# EAGLE design traduttore (EAGLE 9.1.2)
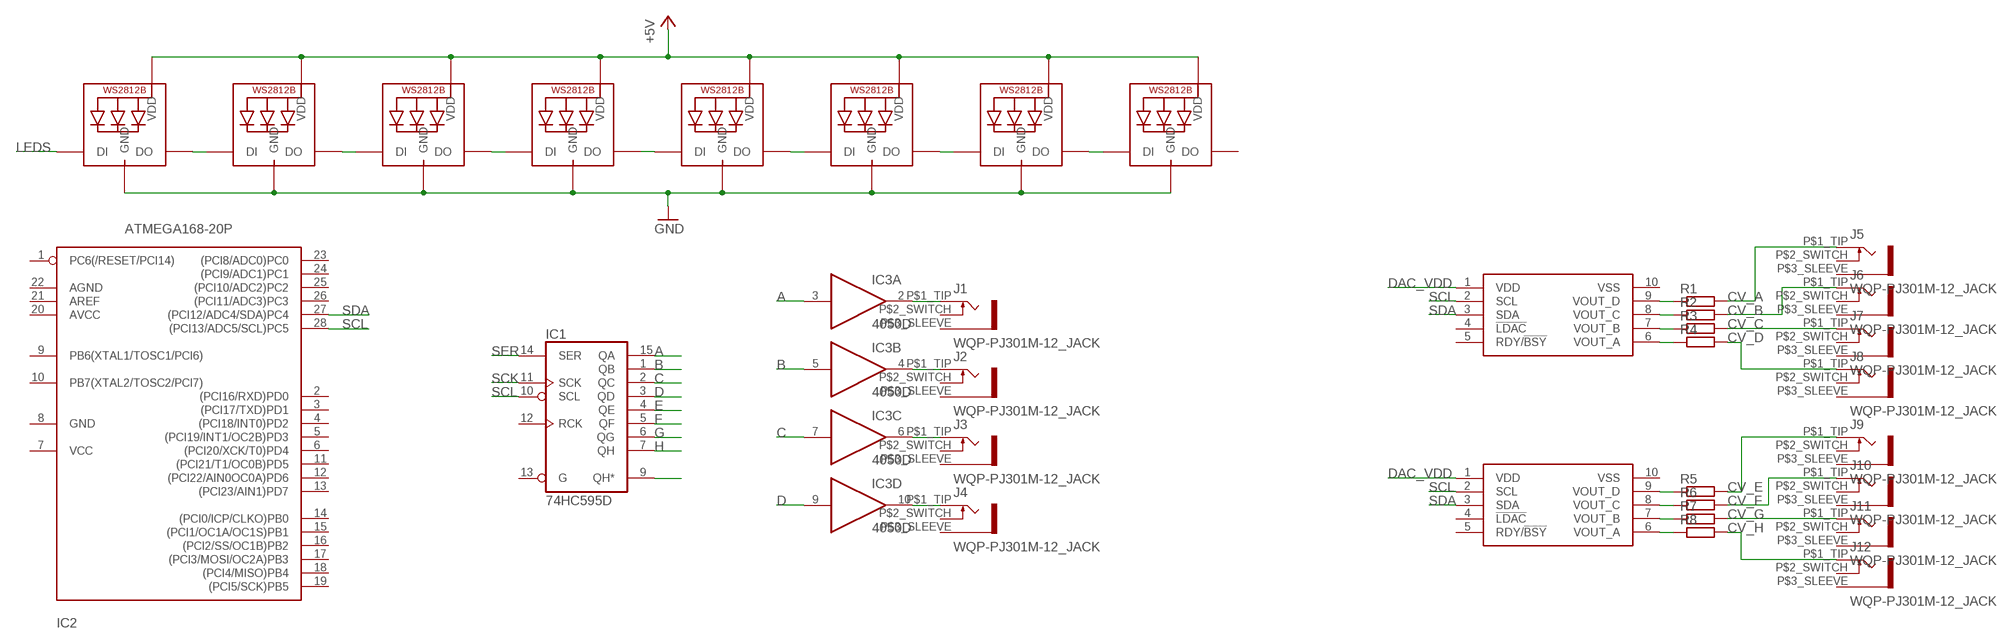
[diagram p0: schematic, sheet 1]

## Parts
IC1  74HC595D  [SO16]
IC2  ATMEGA168-20P  [DIL28-3]
IC3  4050D  [SO16]
J1  WQP-PJ301M-12_JACK  [WQP-PJ301M-12_JACK]
J2  WQP-PJ301M-12_JACK  [WQP-PJ301M-12_JACK]
J3  WQP-PJ301M-12_JACK  [WQP-PJ301M-12_JACK]
J4  WQP-PJ301M-12_JACK  [WQP-PJ301M-12_JACK]
J5  WQP-PJ301M-12_JACK  [WQP-PJ301M-12_JACK]
J6  WQP-PJ301M-12_JACK  [WQP-PJ301M-12_JACK]
J7  WQP-PJ301M-12_JACK  [WQP-PJ301M-12_JACK]
J8  WQP-PJ301M-12_JACK  [WQP-PJ301M-12_JACK]
J9  WQP-PJ301M-12_JACK  [WQP-PJ301M-12_JACK]
J10  WQP-PJ301M-12_JACK  [WQP-PJ301M-12_JACK]
J11  WQP-PJ301M-12_JACK  [WQP-PJ301M-12_JACK]
J12  WQP-PJ301M-12_JACK  [WQP-PJ301M-12_JACK]
LED1  WS2812B5050  [WS2812B]
LED2  WS2812B5050  [WS2812B]
LED3  WS2812B5050  [WS2812B]
LED4  WS2812B5050  [WS2812B]
LED5  WS2812B5050  [WS2812B]
LED6  WS2812B5050  [WS2812B]
LED7  WS2812B5050  [WS2812B]
LED8  WS2812B5050  [WS2812B]
R1  R-EU_R0805  [R0805]
R2  R-EU_R0805  [R0805]
R3  R-EU_R0805  [R0805]
R4  R-EU_R0805  [R0805]
R5  R-EU_R0805  [R0805]
R6  R-EU_R0805  [R0805]
R7  R-EU_R0805  [R0805]
R8  R-EU_R0805  [R0805]
U$1  MCP4728  [MSOP10]
U$2  MCP4728  [MSOP10]

## Nets
+5V: LED1.1-VDD(VDD) LED2.1-VDD(VDD) LED3.1-VDD(VDD) LED4.1-VDD(VDD) LED5.1-VDD(VDD) LED6.1-VDD(VDD) LED7.1-VDD(VDD) LED8.1-VDD(VDD)
A: IC1.15(QA) IC3.3(A:I)
B: IC1.1(QB) IC3.5(B:I)
C: IC1.2(QC) IC3.7(C:I)
CV_A: J5.P$1_TIP R1.2
CV_B: J6.P$1_TIP R2.2
CV_C: J7.P$1_TIP R3.2
CV_D: J8.P$1_TIP R4.2
CV_E: J9.P$1_TIP R5.2
CV_F: J10.P$1_TIP R6.2
CV_G: J11.P$1_TIP R7.2
CV_H: J12.P$1_TIP R8.2
D: IC1.3(QD) IC3.9(D:I)
DAC_VDD: U$1.1(VDD) U$2.1(VDD)
E: IC1.4(QE)
F: IC1.5(QF)
G: IC1.6(QG)
GND: LED1.3-GND(GND) LED2.3-GND(GND) LED3.3-GND(GND) LED4.3-GND(GND) LED5.3-GND(GND) LED6.3-GND(GND) LED7.3-GND(GND) LED8.3-GND(GND)
H: IC1.7(QH)
LEDS: LED1.4-DIN(DI)
N$1: LED1.2-DOUT(DO) LED2.4-DIN(DI)
N$2: LED2.2-DOUT(DO) LED3.4-DIN(DI)
N$3: LED3.2-DOUT(DO) LED4.4-DIN(DI)
N$4: LED4.2-DOUT(DO) LED5.4-DIN(DI)
N$5: LED5.2-DOUT(DO) LED6.4-DIN(DI)
N$6: LED6.2-DOUT(DO) LED7.4-DIN(DI)
N$7: LED7.2-DOUT(DO) LED8.4-DIN(DI)
N$8: R1.1 U$1.9(VOUT_D)
N$9: R2.1 U$1.8(VOUT_C)
N$10: R3.1 U$1.7(VOUT_B)
N$11: R4.1 U$1.6(VOUT_A)
N$12: IC1.9(QH*)
N$13: IC3.2(A:O) J1.P$1_TIP
N$14: IC3.4(B:O) J2.P$1_TIP
N$15: IC3.6(C:O) J3.P$1_TIP
N$16: IC3.10(D:O) J4.P$1_TIP
N$17: R5.1 U$2.9(VOUT_D)
N$18: R6.1 U$2.8(VOUT_C)
N$19: R7.1 U$2.7(VOUT_B)
N$20: R8.1 U$2.6(VOUT_A)
SCK: IC1.11(SCK)
SCL: IC1.10(SCL) IC2.28((PCI13/ADC5/SCL)PC5) U$1.2(SCL) U$2.2(SCL)
SDA: IC2.27((PCI12/ADC4/SDA)PC4) U$1.3(SDA) U$2.3(SDA)
SER: IC1.14(SER)
Unconnected: IC1.12(RCK) IC1.13(G) IC2.1(PC6(/RESET/PCI14)) IC2.2((PCI16/RXD)PD0) IC2.3((PCI17/TXD)PD1) IC2.4((PCI18/INT0)PD2) IC2.5((PCI19/INT1/OC2B)PD3) IC2.6((PCI20/XCK/T0)PD4) IC2.7(VCC) IC2.8(GND) IC2.9(PB6(XTAL1/TOSC1/PCI6)) IC2.10(PB7(XTAL2/TOSC2/PCI7)) IC2.11((PCI21/T1/OC0B)PD5) IC2.12((PCI22/AIN0OC0A)PD6) IC2.13((PCI23/AIN1)PD7) IC2.14((PCI0/ICP/CLKO)PB0) IC2.15((PCI1/OC1A/OC1S)PB1) IC2.16((PCI2/SS/OC1B)PB2) IC2.17((PCI3/MOSI/OC2A)PB3) IC2.18((PCI4/MISO)PB4) IC2.19((PCI5/SCK)PB5) IC2.20(AVCC) IC2.21(AREF) IC2.22(AGND) IC2.23((PCI8/ADC0)PC0) IC2.24((PCI9/ADC1)PC1) IC2.25((PCI10/ADC2)PC2) IC2.26((PCI11/ADC3)PC3) IC3.11(E:I) IC3.12(E:O) IC3.14(F:I) IC3.15(F:O) J1.P$2_SWITCH J1.P$3_SLEEVE J2.P$2_SWITCH J2.P$3_SLEEVE J3.P$2_SWITCH J3.P$3_SLEEVE J4.P$2_SWITCH J4.P$3_SLEEVE J5.P$2_SWITCH J5.P$3_SLEEVE J6.P$2_SWITCH J6.P$3_SLEEVE J7.P$2_SWITCH J7.P$3_SLEEVE J8.P$2_SWITCH J8.P$3_SLEEVE J9.P$2_SWITCH J9.P$3_SLEEVE J10.P$2_SWITCH J10.P$3_SLEEVE J11.P$2_SWITCH J11.P$3_SLEEVE J12.P$2_SWITCH J12.P$3_SLEEVE LED8.2-DOUT(DO) U$1.4(!LDAC) U$1.5(RDY/!BSY) U$1.10(VSS) U$2.4(!LDAC) U$2.5(RDY/!BSY) U$2.10(VSS)

## Power pins joined to a net without a drawn wire
GND: IC1.8(GND)
VCC: IC1.16(VCC)
VDD: IC3.1(P:VDD)
VSS: IC3.8(P:VSS)

## Library data of the parts
IC1 = 74xx-eu:74*595: 8-bit SHIFT REGISTER, output latch
IC2 = adafruit:ATMEGA168*P: MICROCONTROLLER 16 kBytes FLASH 1 kBytes SRAM 512 Bytes EEPROM USART 8-channel 10 bit ADC
IC3 = 40xx:4050: Hex non-inverting BUFFER
J1-J12 = MusicThingModular:WQP-PJ301M-12_JACK
LED1-LED8 = adafruit:WS2812B
R1-R8 = resistor:R-EU_: RESISTOR, European symbol
U$1 U$2 = Eagle-Library:MCP4728

## Board
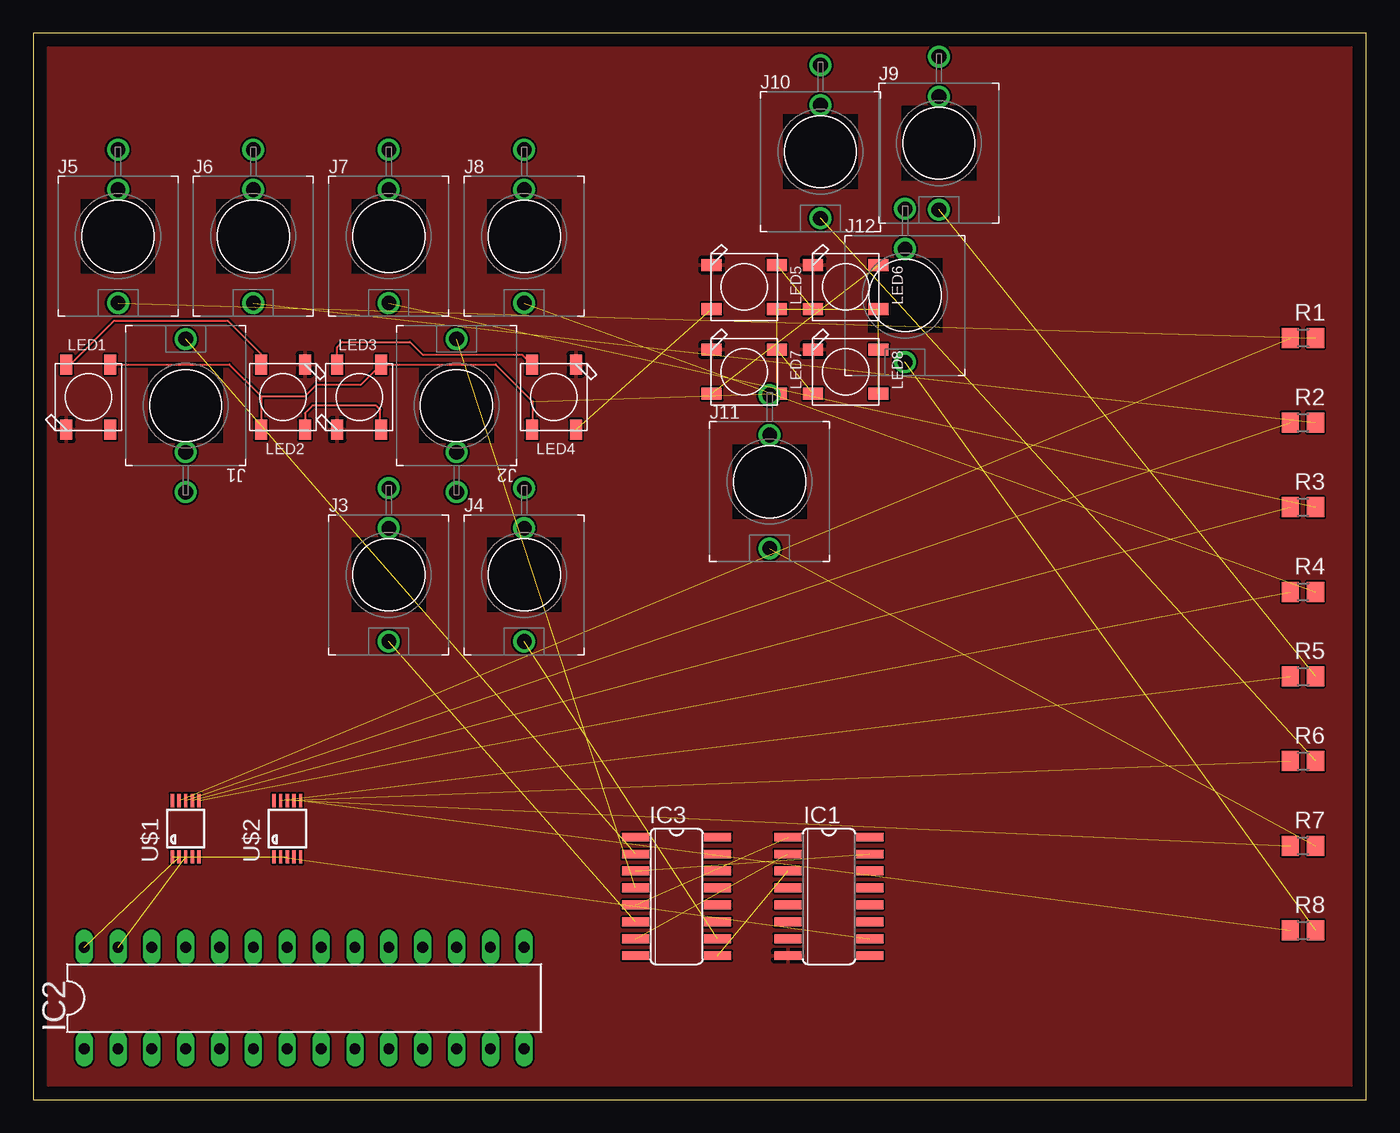
[diagram p1: board, top side]

Size 100 x 80 mm. Coordinates in mm from the lower left corner, seen from the top.
Outline: 0,0 100,0 100,80 0,80 0,0
Copper layers (1*16): Top 0.035mm / dielectric 1.5mm / Bottom 0.035mm
Design rules "default": minimum track width 6mil, minimum drill 0.35mm, track to track 6mil, track to pad 6mil, pad to pad 6mil, via to via 6mil, smd to smd 6mil, copper to edge 40mil, drill to drill 6mil, minimum pad ring 10mil, minimum via ring 8mil, stop-mask expansion 4mil, vias tented up to drill 0mil, thermal gap 10mil

### Footprints (pad centres in the part's own frame; a part is rotated, then mirrored left to right if it is on the bottom)
SO16 = smd 0.66 x 2.032: 1 -4.445,-3.073; 2 -3.175,-3.073; 3 -1.905,-3.073; 4 -0.635,-3.073; 5 0.635,-3.073; 6 1.905,-3.073; 7 3.175,-3.073; 8 4.445,-3.073; 9 4.445,3.073; 10 3.175,3.073; 11 1.905,3.073; 12 0.635,3.073; 13 -0.635,3.073; 14 -1.905,3.073; 15 -3.175,3.073; 16 -4.445,3.073
DIL28-3 = drill 0.813 long: 1 -16.51,-3.81; 2 -13.97,-3.81; 3 -11.43,-3.81; 4 -8.89,-3.81; 5 -6.35,-3.81; 6 -3.81,-3.81; 7 -1.27,-3.81; 8 1.27,-3.81; 9 3.81,-3.81; 10 6.35,-3.81; 11 8.89,-3.81; 12 11.43,-3.81; 13 13.97,-3.81; 14 16.51,-3.81; 15 16.51,3.81; 16 13.97,3.81; 17 11.43,3.81; 18 8.89,3.81; 19 6.35,3.81; 20 3.81,3.81; 21 1.27,3.81; 22 -1.27,3.81; 23 -3.81,3.81; 24 -6.35,3.81; 25 -8.89,3.81; 26 -11.43,3.81; 27 -13.97,3.81; 28 -16.51,3.81
WQP-PJ301M-12_JACK = drill 1.1: P$1_TIP 0,5; P$2_SWITCH 0,-3.5; P$3_SLEEVE 0,-6.5
WS2812B = smd 1.5 x 0.9: 1-VDD 2.45,-1.65; 2-DOUT 2.45,1.65; 3-GND -2.45,1.65; 4-DIN -2.45,-1.65
R0805 = smd 1.3 x 1.5: 1 -0.95,0; 2 0.95,0
MSOP10 = smd 0.25 x 1: 1 -1,-2.113; 2 -0.5,-2.113; 3 0,-2.113; 4 0.5,-2.113; 5 1,-2.113; 6 1,2.113; 7 0.5,2.113; 8 0,2.113; 9 -0.5,2.113; 10 -1,2.113

### Placement (x,y rotation side)
IC1  59.69,15.24 270 top
IC2  20.32,7.62 0 top
IC3  48.26,15.24 270 top
J1  11.43,52.07 0 top
J2  31.75,52.07 0 top
J3  26.67,39.37 180 top
J4  36.83,39.37 180 top
J5  6.35,64.77 180 top
J6  16.51,64.77 180 top
J7  26.67,64.77 180 top
J8  36.83,64.77 180 top
J9  67.94,71.75 180 top
J10  59.05,71.12 180 top
J11  55.24,46.35 180 top
J12  65.41,60.33 180 top
LED1  4.13,52.7 90 top
LED2  18.73,52.7 270 top
LED3  24.45,52.7 90 top
LED4  39.05,52.7 270 top
LED5  53.34,60.96 0 top
LED6  60.96,60.96 0 top
LED7  53.34,54.61 0 top
LED8  60.96,54.61 0 top
R1  95.25,57.15 0 top
R2  95.25,50.8 0 top
R3  95.25,44.45 0 top
R4  95.25,38.1 0 top
R5  95.25,31.75 0 top
R6  95.25,25.4 0 top
R7  95.25,19.05 0 top
R8  95.25,12.7 0 top
U$1  11.43,20.32 0 top
U$2  19.05,20.32 0 top

### Tracks (layer width: path | path; a pad name or v marks a point on that pad's centre or on a via)
+5V  (4 unrouted)
  Top 0.152: LED1.1-VDD 14.7,55.16 17.08,52.77 | 17.08,52.77 LED2.1-VDD | 17.08,52.77 20.38,52.77 21.27,53.66 24.6,53.66 LED3.1-VDD 34.7,55.16 37.47,52.39 37.47,50.32 LED4.1-VDD
A  (1 unrouted)
B  (1 unrouted)
C  (1 unrouted)
CV_A  (1 unrouted)
CV_B  (1 unrouted)
CV_C  (1 unrouted)
CV_D  (1 unrouted)
CV_E  (1 unrouted)
CV_F  (1 unrouted)
CV_G  (1 unrouted)
CV_H  (1 unrouted)
D  (1 unrouted)
DAC_VDD  (1 unrouted)
GND
  pour Top: 0,80.01 100.33,80.01 100.33,0 0,0
N$1
  Top 0.152: LED1.2-DOUT 2.77,55.16 6.03,58.42 14.61,58.42 17.08,55.94 LED2.4-DIN
N$2
  Top 0.152: LED3.4-DIN 26.04,50.32 26.04,51.75 25.72,52.07 20.95,52.07 20.38,51.5 LED2.2-DOUT
N$3
  Top 0.152: LED3.2-DOUT 22.8,56.45 23.18,56.83 28.26,56.83 29.21,55.88 36.68,55.88 LED4.4-DIN
N$4  (1 unrouted)
N$5  (1 unrouted)
N$6  (1 unrouted)
N$7  (1 unrouted)
N$8  (1 unrouted)
N$9  (1 unrouted)
N$10  (1 unrouted)
N$11  (1 unrouted)
N$13  (1 unrouted)
N$14  (1 unrouted)
N$15  (1 unrouted)
N$16  (1 unrouted)
N$17  (1 unrouted)
N$18  (1 unrouted)
N$19  (1 unrouted)
N$20  (1 unrouted)
SCL  (3 unrouted)
SDA  (2 unrouted)